# EAGLE design PowerBoard (EAGLE 6.2)
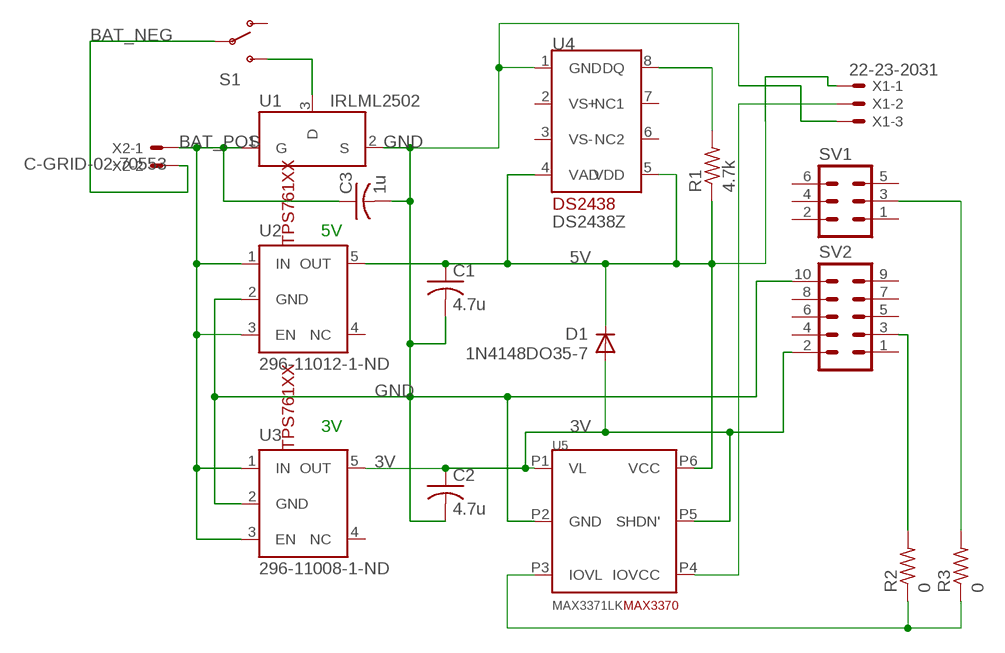
[diagram p0: schematic, sheet 1]

## Parts
C1  4.7u  C-USC0805  [C0805]
C2  4.7u  C-USC0805  [C0805]
C3  1u  C-USC0805  [C0805]
D1  1N4148DO35-7  [DO35-7]
R1  4.7k  R-US_M0805  [M0805]
R2  0  R-US_R0805  [R0805]
R3  0  R-US_R0805  [R0805]
S1  SWITCH-SPST-SMD-A  [SWITCH-SPST-SMD-A]
SV1  MA03-2  [MA03-2]
SV2  MA05-2  [MA05-2]
U1  IRLML2502  [SOT23]
U2  296-11012-1-ND  [SOT23-DBV]
U3  296-11008-1-ND  296-11012-1-ND  [SOT23-DBV]
U4  DS2438Z  [SOIC08]
U5  MAX3371LK  [6-LEAD-SC70]
X1  22-23-2031  [22-23-2031]
X2  C-GRID-02-70553  [70553-02]

## Nets
3V: C2.1 D1.A SV2.2 U3.5(OUT) U5.P1(VL) U5.P5(SHDN')
5V: C1.1 D1.C R1.1 U2.5(OUT) U4.4(VAD) U4.5(VDD) U5.P6(VCC) X1.1
BAT_NEG: S1.2(P) X2.2
BAT_POS: C3.1 U1.1(G) U2.1(IN) U2.3(EN) U3.1(IN) U3.3(EN) X2.1
GND: C1.2 C2.2 C3.2 SV2.10 U1.2(S) U2.2(GND) U3.2(GND) U4.1(GND) U5.P2(GND) X1.3
N$1: R2.1 R3.1 U5.P3(IOVL)
N$2: S1.3(S) U1.3(D)
N$3: R1.2 U4.8(DQ)
N$4: U5.P4(IOVCC) X1.2
N$5: R3.2 SV1.3
N$6: R2.2 SV2.3
Unconnected: S1.1(O) SV1.1 SV1.2 SV1.4 SV1.5 SV1.6 SV2.1 SV2.4 SV2.5 SV2.6 SV2.7 SV2.8 SV2.9 U2.4(NC) U3.4(NC) U4.2(VS+) U4.3(VS-) U4.6(NC2) U4.7(NC1)

## Notes on the sheet
- 5V
- 3V

## Library data of the parts
C1-C3 = rcl:C-US: CAPACITOR, American symbol
D1 = diode:1N4148: DIODE high speed (Philips)
R1-R3 = rcl:R-US_: RESISTOR, American symbol
S1 = SparkFun:SWITCH-SPST: SPST Switch Simple slide switch. Spark Fun Electronics SKU : COM-00102
SV1 = con-lstb:MA03-2: PIN HEADER; OC_FARNELL: unknown; OC_NEWARK: unknown
SV2 = con-lstb:MA05-2: PIN HEADER; OC_FARNELL: unknown; OC_NEWARK: unknown
U1 = BatteryBoard:IRLML2502: SOT-23 HEXFET Power MOSFET http://www.irf.com/product-info/datasheets/data/irlml2502pbf.pdf
U2 U3 = BatteryBoard:296-11012-1-ND: LOW-POWER 100-mA LOW-DROPOUT LINEAR REGULATOR SOT-23-5 3V-TPS76130DBVT 5V-TPS76150DBVT
U4 = BatteryBoard:DS2438Z: DS2438 Smart Battery Monitor SOIC-8 The DS2438 Smart Battery Monitor provides several functions that are desirable to carry in a battery pack: a means of tagging a battery pack with a unique serial number, a direct-to-digital temperature sensor which eliminates the need for thermistors in the battery pack, an A/D converter which measures the battery voltage and current, an integrated current accumulator which keeps a running total of all current going into and out of the battery, an elapsed time meter, and 40 bytes of nonvolatile EEPROM memory for storage of important parameters such as battery chemistry, battery capacity, charging methodology and assembly date. Information is sent to/from the DS2438 over a 1-Wire interface, so that only one wire (and ground) needs to be connected from a central microprocessor to a DS2438. This means that battery packs need only have three output connectors: battery power, ground, and the 1-Wire interface. Because each DS2438 contains a unique silicon serial number, multiple DS2438s can exist on the same 1-Wire bus. This allows multiple battery packs to be charged or used in the system simultaneously. Applications for the smart battery monitor include portable computers, cellular telephones, and handheld instrumentation battery packs in which it is critical to monitor real-time battery performance. Used in conjunction with a microcontroller in the host system, the DS2438 provides a complete smart battery pack solution that is fully chemistry-independent. The customization for a particular battery chemistry and capacity is realized in the code programmed into the microcontroller and DS2438 EEPROM, and only a software revision is necessary should a designer wish to change battery pack chemistry
U5 = BatteryBoard:MAX3371
X1 = con-molex:22-23-2031: .100" (2.54mm) Center Header - 3 Pin; MF: MOLEX; MPN: 22-23-2031; OC_FARNELL: 1462950; OC_NEWARK: 30C0862
X2 = con-molex:C-GRID-02: CONNECTOR wire to board 2.54 mm (0.100") pitch header; OC_FARNELL: unknown; OC_NEWARK: unknown

## Board
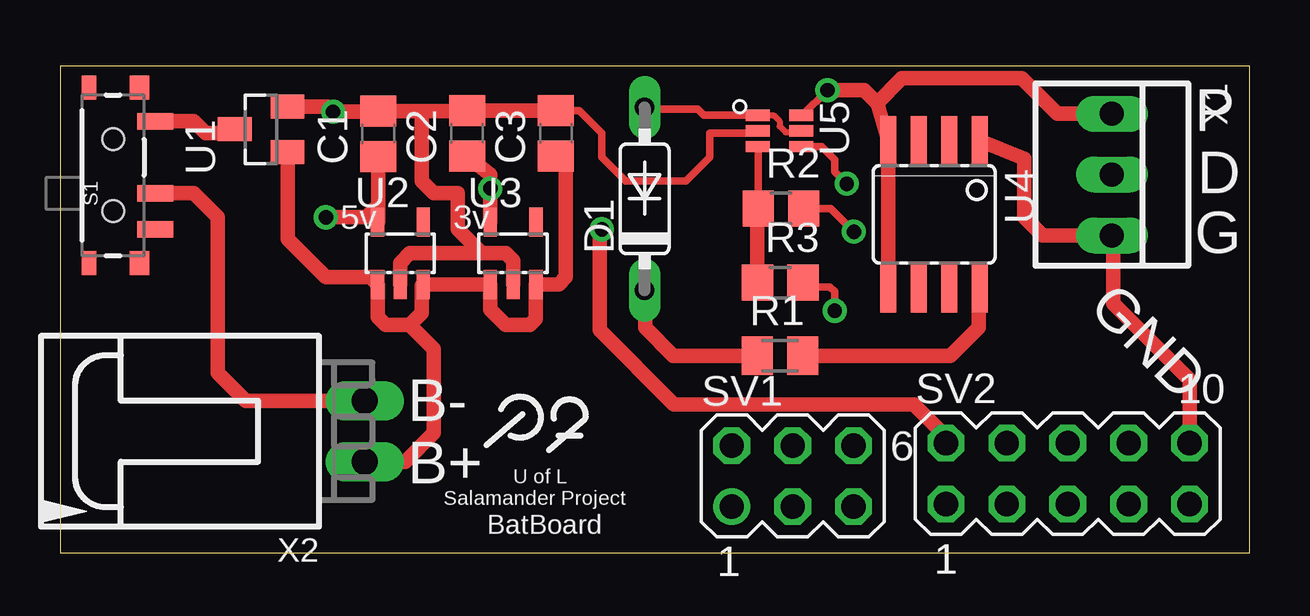
[diagram p1: board, top side]
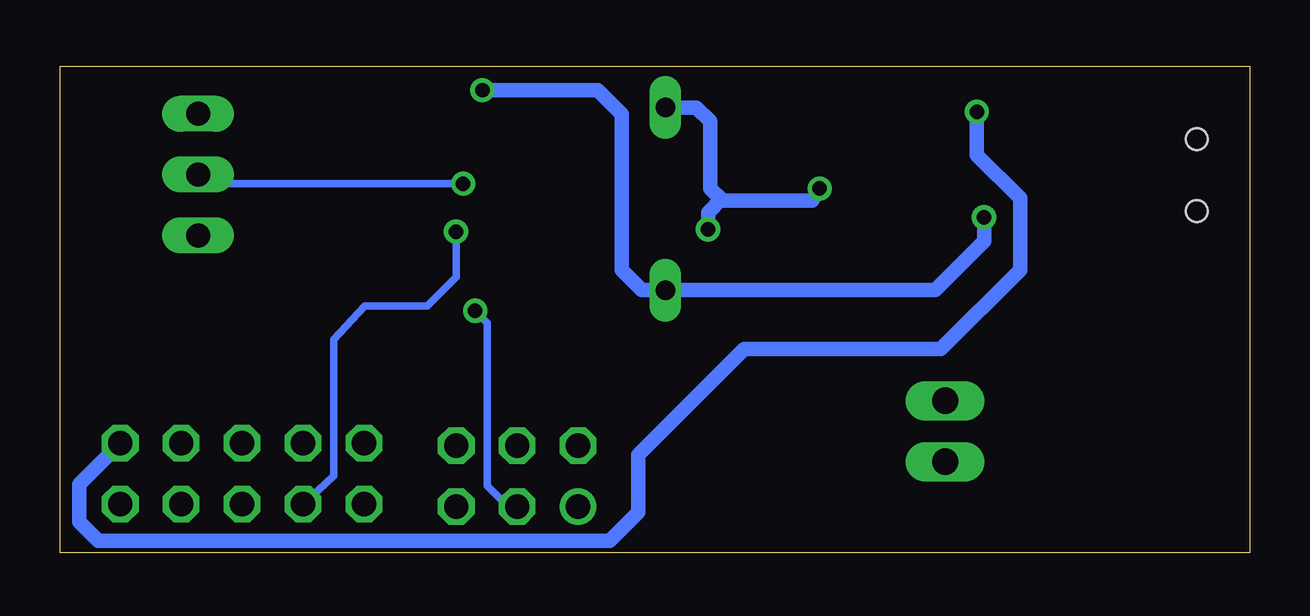
[diagram p2: board, bottom side, seen from below]

Size 49.58 x 20.3 mm. Coordinates in mm from the lower left corner, seen from the top.
Outline: 0,0 49.58,0 49.58,20.3 0,20.3 0,0
Copper layers (1*16): Top 0.035mm / dielectric 1.5mm / Bottom 0.035mm
Design rules: minimum track width 10mil, minimum drill 24mil, track to track 8mil, track to pad 8mil, pad to pad 8mil, via to via 8mil, smd to smd 8mil, copper to edge 40mil, drill to drill 8mil, minimum pad ring 10mil, minimum via ring 8mil, stop-mask expansion 4mil, vias tented up to drill 0mil, thermal gap 10mil

### Footprints (pad centres in the part's own frame; a part is rotated, then mirrored left to right if it is on the bottom)
C0805 = smd 1.3 x 1.5: 1 -0.95,0; 2 0.95,0
DO35-7 = drill 0.813 long: A 3.81,0; C -3.81,0
M0805 = smd 1.3 x 1.6: 1 -0.95,0; 2 0.95,0
R0805 = smd 1.3 x 1.5: 1 -0.95,0; 2 0.95,0
SWITCH-SPST-SMD-A = smd 0.7 x 1.5: 1 -2.25,-1.75; 2 -0.75,-1.75; 3 2.25,-1.75 | smd 1 x 0.6: GND1 -3.65,1; GND3 3.65,1 | smd 1 x 0.8: GND2 -3.65,-1.1; GND4 3.65,-1.1 | hole 0.9: -1.5,0; 1.5,0
MA03-2 = drill 1.016: 1 -2.54,-1.27 | drill 1.016 octagon: 2 -2.54,1.27; 3 0,-1.27; 4 0,1.27; 5 2.54,-1.27; 6 2.54,1.27
MA05-2 = drill 1.016 octagon: 1 -5.08,-1.27; 2 -5.08,1.27; 3 -2.54,-1.27; 4 -2.54,1.27; 5 0,-1.27; 6 0,1.27; 7 2.54,-1.27; 8 2.54,1.27; 9 5.08,-1.27; 10 5.08,1.27
SOT23 = smd 1 x 1.4: 1 -0.95,-1.1; 2 0.95,-1.1; 3 0,1.1
SOT23-DBV = smd 0.55 x 1.2: 1 -0.95,-1.3; 2 0,-1.3; 3 0.95,-1.3; 4 0.95,1.3; 5 -0.95,1.3
SOIC08 = smd 0.66 x 2.032: 1 -1.905,-3.073; 2 -0.635,-3.073; 3 0.635,-3.073; 4 1.905,-3.073; 5 1.905,3.073; 6 0.635,3.073; 7 -0.635,3.073; 8 -1.905,3.073
6-LEAD-SC70 = smd 0.47 x 1: P1 -0.65,0; P2 0,0; P3 0.65,0; P4 0.65,1.8; P5 0,1.8; P6 -0.65,1.8
22-23-2031 = drill 1 long: 1 -2.54,0; 2 0,0; 3 2.54,0
70553-02 = drill 1.092 long: 1 -1.27,-7.62; 2 1.27,-7.62

### Placement (x,y rotation side)
C1  13.26,17.48 90 top
C2  16.96,17.5 90 top
C3  20.66,17.5 90 top
D1  24.36,14.77 90 top
R1  30,8.22 0 top
R2  30.04,14.37 0 top
R3  30.01,11.27 0 top
S1  2.21,15.75 90 top
SV1  30.53,3.21 0 top
SV2  41.99,3.31 0 top
U1  8.38,17.67 90 top
U2  14.18,12.5 0 top
U3  18.88,12.5 0 top
U4  36.42,14.12 180 top
U5  29.08,17.6 270 top
X1  43.83,15.78 270 top
X2  5.08,5.08 90 top

### Tracks (layer width: path | path; a pad name or v marks a point on that pad's centre or on a via)
3V  (via drill 0.6)
  Top 0.254: U5.P1 29.73,18.25 29.98,18 29.98,17.8 30.23,17.55 30.83,17.55 U5.P5
  Top 0.305: U5.P1 26.83,18.25 26.58,18.5 24.44,18.5 D1.A
  Top 0.61: U3.5 v17.93,15.2 17.93,15.78 C2.1 | SV2.2 36.91,4.87 35.58,6.2 25.58,6.2 22.48,9.3 22.48,13.4 v22.58,13.5
  Bottom 0.61: D1.A 23.06,18.58 22.48,18 22.48,15.2 22.03,14.75 | 22.03,14.75 21.98,14.7 18.23,14.7 v17.93,15.2 | v22.58,13.5 22.58,14.2 22.03,14.75
5V  (via drill 0.6)
  Top 0.305: U5.P6 30.93,18.25 v31.98,19.3
  Top 0.61: C1.1 13.26,14.5 | 13.26,14.5 13.26,13.83 U2.5 | v11.08,14 12.76,14 13.26,14.5 | R1.1 25.56,8.22 24.38,9.4 24.38,10.94 D1.C | v31.98,19.3 33.51,19.3 34.04,18.76 | 34.04,18.76 U4.4 U4.5 | X1.1 41.56,18.32 40.08,19.8 35.08,19.8 34.04,18.76
  Bottom 0.61: v11.08,14 11.08,13 13.12,10.96 D1.C 25.34,10.96 26.18,11.8 26.18,18.3 27.18,19.3 v31.98,19.3
BAT_NEG
  Top 0.61: X2.2 7.73,6.35 6.58,7.5 6.58,14 5.58,15 S1.2
BAT_POS
  Top 0.61: 14.58,9.5 13.58,9.5 13.23,9.85 U2.1 12.93,11.5 11.08,11.5 9.48,13.1 U1.1 | 14.58,9.5 15.08,10 15.08,11.15 U2.3 U3.1 17.93,10.15 18.58,9.5 19.58,9.5 19.83,9.75 U3.3 20.78,11.2 21.08,11.5 21.08,16.13 C3.1 | X2.1 14.39,3.81 15.58,5 15.58,8.5 14.58,9.5
GND  (via drill 0.6)
  Top 0.305: C3.2 21.63,18.45 22.58,17.5 22.58,16.5 23.58,15.5 26.08,15.5 27.08,16.5 27.08,17.5 28.98,17.5 U5.P2
  Top 0.406: C2.2 17.37,18.18
  Top 0.61: 13.07,18.62 C1.2 | C1.2 15.08,18.43 | 15.08,18.43 17.12,18.43 17.37,18.18 | C3.2 C2.2 | U3.2 18.88,12.2 18.58,12.5 17.58,12.5 | 17.58,12.5 14.58,12.5 14.18,12.1 U2.2 | 17.58,12.5 16.58,13.5 16.58,15 15.58,15 15.08,15.5 15.08,18.43 | SV2.10 47.07,7.21 43.88,10.4 43.88,13.19 X1.3 40.94,13.24 40.18,14 40.18,16.44 U4.1 | U1.2 11.16,18.62 v11.38,18.4 13.23,18.4 C1.2
  Bottom 0.61: v11.38,18.4 11.38,16.6 9.58,14.8 9.58,11.8 12.88,8.5 21.08,8.5 25.48,4.1 25.48,1.7 26.68,0.5 47.98,0.5 48.78,1.3 48.78,2.87 SV2.10
N$1
  Top 0.305: R2.1 U5.P3
  Top 0.61: R3.1 29.06,14.34 R2.1
N$2
  Top 0.61: S1.3 5.58,18 6.08,17.5 7.11,17.5 U1.3
N$3
  Top 0.61: R1.2 37.1,8.22 38.28,9.4 38.28,11 U4.8
N$4  (via drill 0.6)
  Top 0.305: U5.P4 31.73,16.95 32.28,16.4 32.28,15.9 v32.78,15.4
  Bottom 0.305: v32.78,15.4 43.45,15.4 X1.2
N$5  (via drill 0.6)
  Top 0.305: v32.28,10.1 32.28,10.9 32.08,11.1 31.13,11.1 R3.2
  Bottom 0.305: SV1.3 30.92,1.94 31.78,2.8 31.78,9.6 v32.28,10.1
N$6  (via drill 0.6)
  Top 0.305: R2.2 32.11,14.37 v33.08,13.4
  Bottom 0.305: v33.08,13.4 33.08,11.5 34.28,10.3 36.88,10.3 38.18,8.9 38.18,3.21 SV2.3

### Text on the board
tPlace: U of L | Salamander Project | BatBoard
tNames: P | D | 5v | 3v | G | GND | B- | B+